# Altium schematic sheet MCU.SchDoc
size A4; SheetNumber: 3; SheetTotal: 10
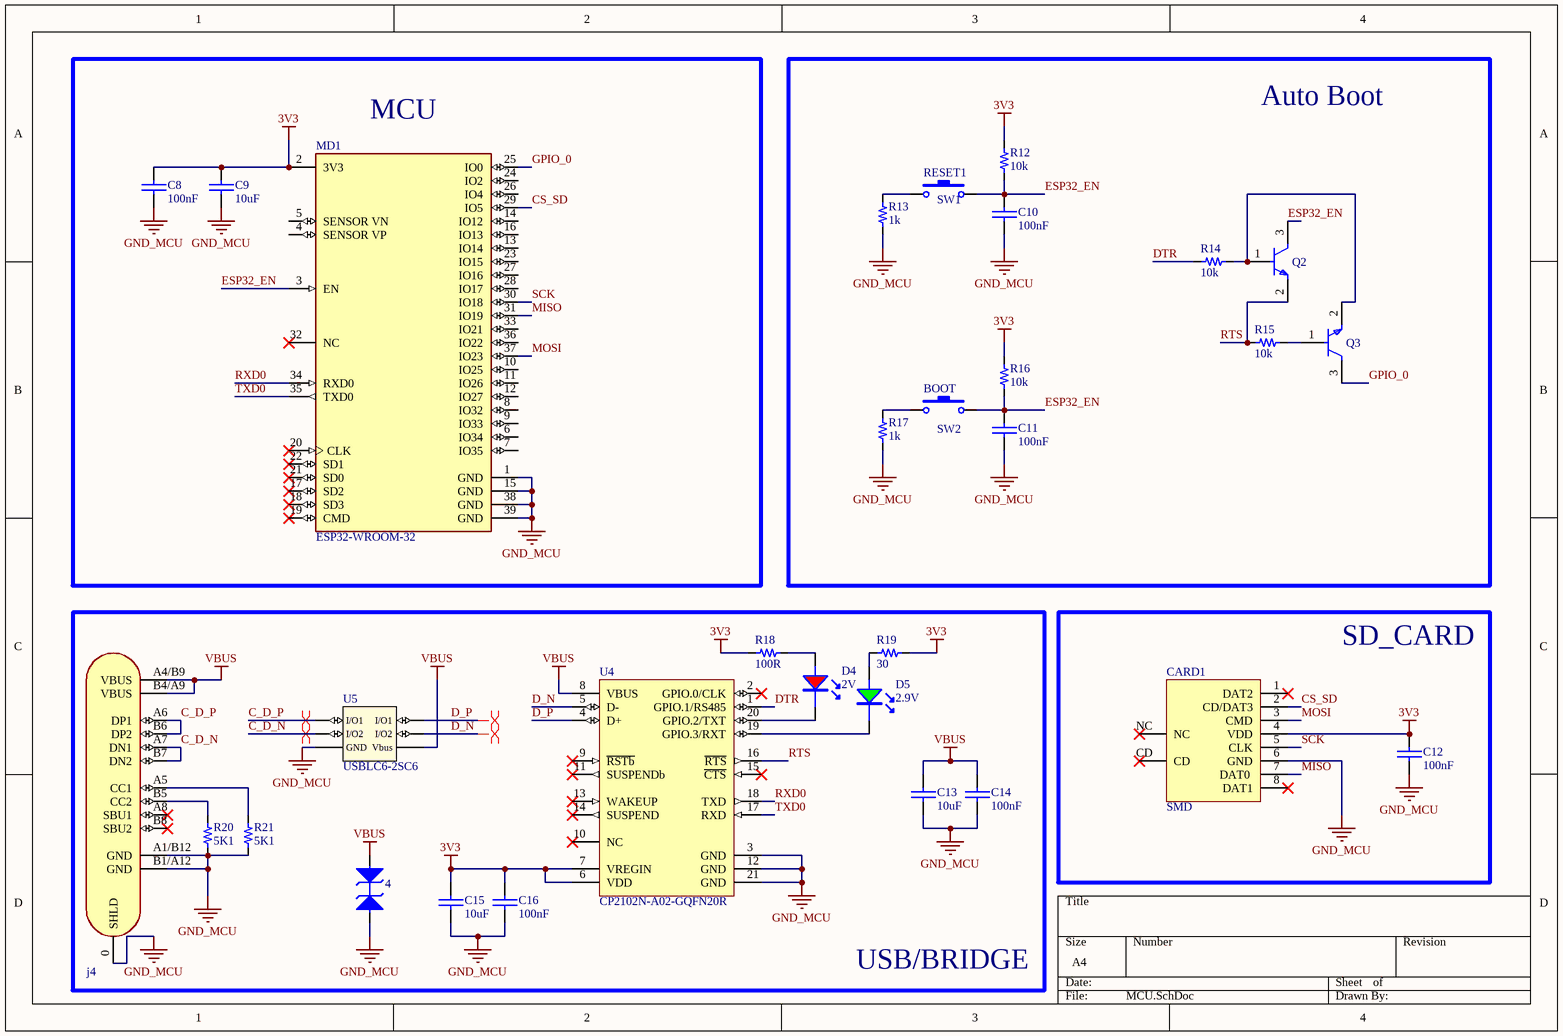
[diagram p0: MCU.SchDoc]

## Parts
4  TVS 12V  [SOD_123FL]  (value not drawn)
C8  value 100nF  [0603_cap]  (hidden comment: CAP CER 100nF 50V X7R 0603)
C9  value 10uF  [0603_cap]  (hidden comment: 10uF 10V)
C10  value 100nF  [0603_cap]  (hidden comment: CAP CER 100nF 50V X7R 0603)
C11  value 100nF  [0603_cap]  (hidden comment: CAP CER 100nF 50V X7R 0603)
C12  value 100nF  [0603_cap]  (hidden comment: CAP CER 100nF 50V X7R 0603)
C13  value 10uF  [0603_cap]  (hidden comment: 10uF 10V)
C14  value 100nF  [0603_cap]  (hidden comment: CAP CER 100nF 50V X7R 0603)
C15  value 10uF  [0603_cap]  (hidden comment: 10uF 10V)
C16  value 100nF  [0603_cap]  (hidden comment: CAP CER 100nF 50V X7R 0603)
CARD1  SMD  [SD_CARD_PUSH_PCB]
D4  2V  [0805_LED]
D5  2.9V  [0805_LED]
j4  USB C  [CON_USB_C_16P_RA]  (value not drawn)
MD1  ESP32-WROOM-32
Q2  TRANS NPN 40V 200mA SOT-23  (value not drawn)
Q3  TRANS NPN 40V 200mA SOT-23  (value not drawn)
R12  value 10k  [0603_res]  (hidden comment: 10k 1/10W)
R13  value 1k  [0603_res]  (hidden comment: 1k 1/10W)
R14  value 10k  [0603_res]  (hidden comment: 10k 1/10W)
R15  value 10k  [0603_res]  (hidden comment: 10k 1/10W)
R16  value 10k  [0603_res]  (hidden comment: 10k 1/10W)
R17  value 1k  [0603_res]  (hidden comment: 1k 1/10W)
R18  value 100R  [0603_res]  (hidden comment: 100R 1/10W)
R19  value 30  [0603_res]  (hidden comment: RES 30Ω ±5% 100mW 0603)
R20  value 5K1  [0603_res]  (hidden comment: RES 5.1kΩ ±1% 100mW 0603)
R21  value 5K1  [0603_res]  (hidden comment: RES 5.1kΩ ±1% 100mW 0603)
SW1  Sw  [Sw_PUSH_4.5x4.5x5mm]  (value not drawn)
SW2  Sw  [Sw_PUSH_4.5x4.5x5mm]  (value not drawn)
U4  CP2102N-A02-GQFN20R  [WFQFN_20_EP_3X3MM]
U5  USBLC6-2SC6  [SOT_23_6]

## Blocks framed on the sheet
MCU: C8 C9 MD1
Auto Boot: C10 C11 Q2 Q3 R12-R17 SW1 SW2
USB/BRIDGE: 4 C13-C16 D4 D5 j4 R18-R21 U4 U5
SD_CARD: C12 CARD1

## Nets
3V3: C8.1 C9.1 C12.1 C15.1 C16.1 CARD1.4(VDD) MD1.2(3V3) R12.2 R16.2 R18.1 R19.2 U4.6(VDD) U4.7(VREGIN)
GND_MCU: 4.2 C8.2 C9.2 C10.2 C11.2 C12.2 C13.2 C14.2 C15.2 C16.2 CARD1.6(GND) j4.0(SHLD) j4.A1/B12(GND) j4.B1/A12(GND) MD1.1(GND) MD1.15(GND) MD1.38(GND) MD1.39(GND) R13.1 R17.1 R20.1 R21.1 U4.3(GND) U4.12(GND) U4.21(GND) U5.2(GND)
VBUS: 4.1 C13.1 C14.1 j4.A4/B9(VBUS) j4.B4/A9(VBUS) U4.8(VBUS) U5.5(Vbus)
C_D_N: j4.A7(DN1) j4.B7(DN2) U5.3(I/O2)
C_D_P: j4.A6(DP1) j4.B6(DP2) U5.1(I/O1)
CS_SD: CARD1.2(CD/DAT3) MD1.29(IO5)
D_N: U4.5(D-) U5.4(I/O2)
D_P: U4.4(D+) U5.6(I/O1)
DTR: R14.2 U4.1(GPIO.1/RS485)
ESP32_EN: C10.1 C11.1 MD1.3(EN) Q2.3(C) R12.1 R16.1 SW1.2 SW2.2
GPIO_0: MD1.25(IO0) Q3.3(C)
MISO: CARD1.7(DAT0) MD1.31(IO19)
MOSI: CARD1.3(CMD) MD1.37(IO23)
RTS: Q2.2(E) R15.2 U4.16(~{RTS})
RXD0: MD1.34(RXD0) U4.18(TXD)
SCK: CARD1.5(CLK) MD1.30(IO18)
TXD0: MD1.35(TXD0) U4.17(RXD)
NetD4_1: D4.1(A) R18.2
NetD4_2: D4.2 U4.20(GPIO.2/TXT)
NetD5_1: D5.1(A) R19.1
NetD5_2: D5.2 U4.19(GPIO.3/RXT)
Netj4_A5: j4.A5(CC1) R21.2
Netj4_B5: j4.B5(CC2) R20.2
NetQ2_1: Q2.1(B) Q3.2(E) R14.1
NetQ3_1: Q3.1(B) R15.1
NetR13_2: R13.2 SW1.1
NetR17_2: R17.2 SW2.1

Not connected (* = marked no-connect by the designer): CARD1 1(DAT2)* 8(DAT1)* CD* NC*; j4 A8(SBU1)* B8(SBU2)*; MD1 4(SENSOR_VP) 5(SENSOR_VN) 6(IO34) 7(IO35) 8(IO32) 9(IO33) 10(IO25) 11(IO26) 12(IO27) 13(IO14) 14(IO12) 16(IO13) 17(SD2)* 18(SD3)* 19(CMD)* 20(CLK)* 21(SD0)* 22(SD1)* 23(IO15) 24(IO2) 26(IO4) 27(IO16) 28(IO17) 32(NC)* 33(IO21) 36(IO22); U4 2(GPIO.0/CLK)* 9(~{RSTb})* 10(NC)* 11(SUSPENDb)* 13(WAKEUP)* 14(SUSPEND)* 15(~{CTS})*

## Layout directives
differential pair: C_D_N, C_D_P, D_N, D_P

## Notes on the sheet
- (near SW1) RESET1
- (near SW2) BOOT

## Library data of the parts
4 = TVS_5V_1CH_BID_SOD_123FL: 21.7A 200W@10/1000us 9.2V 7V Bidirectional 5V SOD-123FL ESD and Surge Protection (TVS/ESD) ROHS; Manufacturer: TDSEMIC; Manufacturer Part Number: SMF5.0CA; Supplier 1: LCSC; Supplier Part Number 1: C46956338; ComponentLink1Description: LCSC; ComponentLink1URL: https://lcsc.com/product-detail/ESD-and-Surge-Protection-TVS-ESD_TDSEMIC-SMF5-0CA_C46956338.html
C8 C10-C12 C14 C16 = Cap_100nF_0603_50V: 50V 100nF X7R ±10% 0603 Ceramic Capacitors RoHS; Manufacturer: FOJAN; Manufacturer Part Number: FCC0603B104K500CT; Supplier 1: LCSC; Supplier Part Number 1: C5137636; ComponentLink1Description: LCSC; ComponentLink1URL: https://www.lcsc.com/product-detail/C5137636.html
C9 C13 C15 = Cap_10uF_0603_10V: 10V 10uF X5R ±10% 0603 Multilayer Ceramic Capacitors MLCC - SMD/SMT ROHS; Manufacturer: CCTC; Manufacturer Part Number: TCC0603X5R106K100CT; Supplier 1: LCSC; Supplier Part Number 1: C380314; ComponentLink1Description: LCSC; ComponentLink1URL: https://www.lcsc.com/product-detail/Multilayer-Ceramic-Capacitors-MLCC-SMD-SMT_CCTC-TCC0603X5R106K100CT_C380314.html
CARD1 = SD_CARD_PUSH: Push-Push 2mm Connector and Ejector MicroSD Card (TF Card) SMD PC Card Sockets RoHS; Manufacturer: Yuandi; Manufacturer Part Number: TF-01A; Supplier 1: LCSC; Supplier Part Number 1: C2896790; ComponentLink1Description: LCSC; ComponentLink1URL: https://www.lcsc.com/product-detail/C2889258.html?s_z=n_TF-01A_C2889258
D4 = LED_0805_RED: LED RED CLEAR 0805 SMD; Manufacturer: XINGLIGHT; Manufacturer Part Number: XL-2012SURC; Supplier 1: LCSC; Supplier Part Number 1: C965812; ComponentLink1Description: LCSC; ComponentLink1URL: https://www.lcsc.com/product-detail/Light-Emitting-Diodes-LED_XINGLIGHT-XL-2012SURC_C965812.html
D5 = LED_0805_Green: LED GREEN CLEAR 0805 SMD; Manufacturer: XINGLIGHT; Manufacturer Part Number: XL-2012UGC; Supplier 1: LCSC; Supplier Part Number 1: C965815; ComponentLink1Description: LCSC; ComponentLink1URL: https://www.lcsc.com/product-detail/Light-Emitting-Diodes-LED_XINGLIGHT-XL-2012UGC_C965815.html
j4 = CON_USB_TYPEC_16P: 3A USB 3.1 1 Surface Mount 16P Female -40℃~+85℃ Type-C SMD USB Connectors ROHS; Manufacturer: SHOU HAN; Manufacturer Part Number: TYPE-C-3.1-16PIN; Supplier 1: LCSC; Supplier Part Number 1: C7507405; ComponentLink1Description: LCSC; ComponentLink1URL: https://lcsc.com/product-detail/USB-Connectors_SHOU-HAN-TYPE-C-3-1-16PIN_C7507405.html
MD1 = CMP-194065-000003-1: WIFI MODULE 32MBITS SPI FLASH; Manufacturer: ESPRESSIF; Manufacturer Part Number: ESP32-WROOM-32-N4; ComponentLink2URL: https://www.espressif.com/sites/default/files/documentation/esp32-wroom-32d_esp32-wroom-32u_datasheet_en.pdf; ComponentLink2Description: Datasheet; ComponentLink3Description: LCSC; ComponentLink3URL: https://www.lcsc.com/product-detail/C82899.html?s_z=n_ESP32%2520WROOM%2520N4; Supplier 1: LCSC; Supplier Part Number 1: C82899
Q2 Q3 = BJT_N_MMBT3904-7-F: 40V 310mW 200mA NPN SOT-23 Single Bipolar Transistors RoHS; Manufacturer: DIODES; Manufacturer Part Number: MMBT3904-7-F; Supplier 1: LCSC; Supplier Part Number 1: C94514; ComponentLink1Description: LCSC; ComponentLink1URL: https://www.lcsc.com/product-detail/C94514.html?s_z=n_MMBT3904-7-F
R12 R14-R16 = Res_10k_0603_1/10W: RES SMD 10k OHM 5% 1/10W 0603; Manufacturer: FOJAN; Manufacturer Part Number: FRC0603J103TS; ComponentLink1URL: https://www.lcsc.com/product-detail/Chip-Resistor-Surface-Mount_FOJAN-FRC0603J103TS_C2930027.html; Supplier 1: LCSC; Supplier Part Number 1: C2930027; ComponentLink1Description: LCSC
R13 R17 = Res_1k_0603_1/10W: RES SMD 1k OHM 5% 1/10W 0603; Manufacturer: FOJAN; Manufacturer Part Number: FRC0603J102 TS; ComponentLink1URL: https://www.lcsc.com/product-detail/Chip-Resistor-Surface-Mount_FOJAN-FRC0603J102-TS_C2907113.html; Supplier 1: LCSC; Supplier Part Number 1: C2907113; ComponentLink1Description: LCSC
R18 = Res_100R_0603_1/10W: RES SMD 100R OHM 5% 1/10W 0603; Manufacturer: FOJAN; Manufacturer Part Number: FRC0603J101 TS; ComponentLink1URL: https://www.lcsc.com/product-detail/Chip-Resistor-Surface-Mount_FOJAN-FRC0603J101-TS_C2907089.html; Supplier 1: LCSC; Supplier Part Number 1: C2907089; ComponentLink1Description: LCSC
R19 = Res_30_0603_1/10W: 100mW 30Ω 75V ±100ppm/℃ Thick Film Resistor ±5% 0603 Chip Resistor - Surface Mount RoHS; Manufacturer: FOJAN; Manufacturer Part Number: FRC0603J300 TS; ComponentLink1URL: https://www.lcsc.com/product-detail/Chip-Resistor-Surface-Mount_FOJAN-FRC0603J102-TS_C2907113.html; Supplier 1: LCSC; Supplier Part Number 1: C2907150; ComponentLink1Description: LCSC
R20 R21 = Res 5K1: 100mW 5.1kΩ 75V ±100ppm/℃ Thick Film Resistor ±1% 0603 Chip Resistor - Surface Mount RoHS; Manufacturer: FOJAN; Manufacturer Part Number: FRC0603F5101TS; ComponentLink1URL: https://www.lcsc.com/product-detail/C2907044.html?s_z=n_5.1k%2520resistor; Supplier 1: LCSC; Supplier Part Number 1: C2907044; ComponentLink1Description: LCSC
SW1 SW2 = Sw_PUSH_4.5x4.5x5.0xmm: SWITCH TACTILE SPST-NO 0.05A 12V; Manufacturer: BZCN; Manufacturer Part Number: TSC015A05026A; Supplier 1: LCSC; Supplier Part Number 1: C2888509; Last modified by: N-A.Potosi; Last modified date: 20190222; ComponentLink1Description: LCSC; ComponentLink1URL: https://www.lcsc.com/product-detail/Tactile-Switches_BZCN-TSC015A05026A_C2888509.html
U4 = IC_SGL_USB2UART-BRIDGE_20QFN: IC USB TO UART BRIDGE QFN20; Manufacturer: Silicon Labs; Manufacturer Part Number: CP2102N-A02-GQFN20R; Supplier 1: LCSC; Supplier Part Number 1: C969913; ComponentLink1Description: LCSC; ComponentLink1URL: https://www.lcsc.com/product-detail/USB-ICs_SILICON-LABS-CP2102N-A02-GQFN20R_C969913.html
U5 = TVS_5.25V_2CH_SOT_23_6: TVS DIODE 5.25V 17V SOT23-6; Manufacturer: STMicroelectronics; ComponentLink1Description: LCSC; ComponentLink1URL: https://www.lcsc.com/product-detail/ESD-Protection-Devices_STMicroelectronics-USBLC6-2SC6_C7519.html; Supplier 1: LCSC; Manufacturer Part Number: USBLC6-2SC6; Supplier Part Number 1: C7519